# Altium schematic sheet Audio Amplifier 3W PAM8403 Schematics Layout.SchDoc
size A4; SheetNumber: 1; SheetTotal: 1
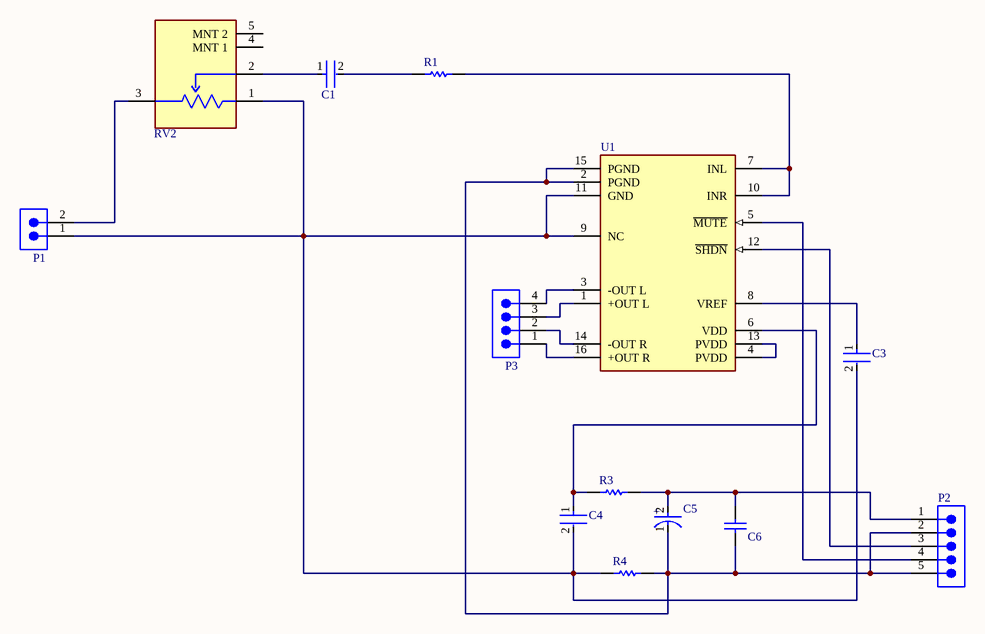
[diagram p0: Audio Amplifier 3W PAM8403 Schematics Layout.SchDoc]

## Parts
C1  LMK063BC6474MPLF  [FP-0201-L_0_6_0_09-W_0_3-MFG]  (value not drawn)
C3  GCD21BR72A104MA01L  [FP-GCD21B-0_15-MFG]  (value not drawn)
C4  GRM188R61A106ME69J  [FP-GRM188-0_15-IPC_C]  (value not drawn)
C5  EEUFM1E101B  [FP-RAD-TH-D_6_3_0_5-L_11-MFG]  (value not drawn)
C6  0805YD105MAT2A  [CAPC2013X140X50NL20T25]  (value not drawn)
P1  61300211121  [61300211121]  (value not drawn)
P2  61300511121  [61300511121]  (value not drawn)
P3  61300411121  [61300411121]  (value not drawn)
R1  20K 5% 1210(3225)  [RESC1210(3225)_M]  (value not drawn)
R3  RC1206FR-1010RL  [RESC3116X65X40LL10T20]  (value not drawn)
R4  SG73S1ETTP1R0J  [RESC1005X40X25LL10T10]  (value not drawn)
RV2  RK09L1140A2U  [FP-RK09L1140A2U-MFG]  (value not drawn)
U1  PAM8403DR  [FP-SO-16-MFG]  (value not drawn)

## Nets
NetC1_1: C1.1 RV2.2
NetC1_2: C1.2 R1.1
NetC3_1: C3.1 U1.8(VREF)
NetC3_2: C3.2 C4.2 P1.1 R4.1 RV2.1 U1.9(NC) U1.11(GND)
NetC4_1: C4.1 R3.1 U1.6(VDD)
NetC5_1: C5.1(C) C6.1 P2.2 P2.5 R4.2 U1.2(PGND) U1.15(PGND)
NetC5_2: C5.2(A) C6.2 P2.1 R3.2
NetP1_2: P1.2 RV2.3
NetP2_3: P2.3 U1.12(~{SHDN})
NetP2_4: P2.4 U1.5(~{MUTE})
NetP3_1: P3.1 U1.16(+OUT_R)
NetP3_2: P3.2 U1.14(-OUT_R)
NetP3_3: P3.3 U1.1(+OUT_L)
NetP3_4: P3.4 U1.3(-OUT_L)
NetR1_2: R1.2 U1.7(INL) U1.10(INR)
NetU1_4: U1.4(PVDD) U1.13(PVDD)

Not connected (* = marked no-connect by the designer): RV2 4(MNT_1) 5(MNT_2)

## Notes on the sheet
- (in symbol CMP-05427-000856-1) +

## Library data of the parts
C1 = CMP-14477-002327-2: 0.47 µF ±20% 10V Ceramic Capacitor X6S 0201 (0603 Metric); RoHS Compliant: Yes
C3 = CMP-06035-062053-1: Chip Multilayer Ceramic Capacitors for Automotive, 0805, 0.10uF, X7R, 15%, 20%, 100V, Grade 1
C4 = CMP-06035-033844-1: Chip Multilayer Ceramic Capacitors for General Purpose, 0603, 10uF, X5R, 15%, 20%, 10V; Dielectric: X5R; Thickness: 800um; Tolerance: 20%; Length: 1.6mm; Voltage Rating (DC): 10V; Width: 800um; Capacitance: 10uF
C5 = CMP-05427-000856-1: Aluminum Electrolytic Capacitors (Radial Lead Type) 100uF ±20% 25V; Lead Diameter: 0.5mm; Polarity: Polar; Ripple Current: 455mA; Impedance: 130mR; Life (Hours): 2000Hour; Length: 11mm; Min Operating Temperature: -40°C; Termination: Radial; Diameter: 6mm; Lead Pitch: 5mm; Tolerance: 20%; Capacitance: 100uF; Case/Package: Radial; Voltage Rating (DC): 25V; Height - Seated (Max): 0.5inch; RoHS Compliant: Yes; Series: FM; Package Quantity: 2000; Voltage Rating: 25V; Max Operating Temperature: 105°C; Mount: Through Hole; ESR (Equivalent Series Resistance): 130mR; Packaging: Tape and Reel
C6 = CMP-2007-04663-1: 1 µF ±20% 16V Ceramic Capacitor X5R 0805 (2012 Metric); Manufacturer: AVX Interconnect / Elco; Part Number: 0805YD105MAT2A
P1 = CMP-1712-00002-7: THT Vertical Pin Header WR-PHD, Pitch 2.54 mm, Single Row, 2 pins; Pitch: 2.54mm; Number of Contacts: 2; Connector Type: Male Pin; Gender: Male; Contact Resistance: 20mΩ; Operating Supply Voltage: 250V; Current Rating: 3A; Housing Material: PBT; RoHS: Compliant; Lead Free: Lead Free; Contact Material: Gold; REACH SVHC: No; Min Operating Temperature: -40°C; Termination: Through Hole; Number of Pins: 2; Contact Gender: Male; Packaging: Bulk; Lead Pitch: 2.54mm; Contact Plating: Gold; Orientation: Vertical; Mount: Through Hole; Height: 8.94mm; Color: Black; Number of Positions: 2; Contact Mating Length: 5.9944mm; Max Operating Temperature: 105°C; Voltage Rating: 250V; Number of Rows: 1
P2 = CMP-1502-01068-4: THT Vertical Pin Header WR-PHD, Pitch 2.54 mm, Single Row, 5 pins; Number of Contacts: 5; Connector Type: Male Pin; Operating Supply Voltage: 250V; Contact Resistance: 20mΩ; Gender: Male; Pitch: 2.54mm; Current Rating: 3A; Min Operating Temperature: -40°C; Contact Material: Gold; Color: Black; RoHS: Compliant; Number of Rows: 1; Lead Free: Lead Free; Height: 8.89mm; Contact Plating: Gold; Number of Pins: 5; Orientation: Vertical; Voltage Rating: 250V; Packaging: Bulk; Number of Positions: 5; Max Operating Temperature: 105°C; Termination: Solder; Lead Pitch: 2.54mm; Contact Mating Length: 5.9944mm; Mount: Through Hole
P3 = CMP-1502-01064-4: THT Vertical Pin Header WR-PHD, Pitch 2.54 mm, Single Row, 4 pins; Connector Type: Male Pin; Gender: Male; Current Rating: 3A; Number of Positions: 4; Operating Supply Voltage: 250V; Contact Resistance: 20mΩ; Pitch: 2.54mm; Max Operating Temperature: 105°C; Mount: Through Hole; Contact Material: Gold; Contact Plating: Gold; Number of Contacts: 4; Orientation: Vertical; Packaging: Bulk; Contact Mating Length: 5.9944mm; Voltage Rating: 250V; Number of Rows: 1; Height: 8.89mm; Lead Free: Lead Free; Lead Pitch: 2.54mm; Number of Pins: 4; Color: Black; Min Operating Temperature: -40°C; RoHS: Compliant; Termination: Solder
R1 = CMP-1015-00105-1: 20K 0.5W 5% 1210 (3225 Metric)  SMD; Value: 20000.00 Ohm; Case-EIA: 1210; Case-Metric: 3225; Power: 0.5 W; Tolerance: 5 %; Technology: SMT
R3 = CMP-2003-03446-1: Manufacturer: Yageo; Part Number: RC1206FR-1010RL
R4 = CMP-2002-04124-1: Manufacturer: KOA Speer; Part Number: SG73S1ETTP1R0J
RV2 = CMP-24118-000002-1: 9mm Size Metal Shaft Snap-in Type RK09L Series; Manufacturer: ALPS; Tolerance: 20%; Resistance: 10kΩ; Standoff Height: 2.55mm; Value: 10kΩ; Power Rating: 0.05W; Voltage Rating: 50V; Lead Free: Yes; Temperature: -10°C to +70°C; Device Class L1: Passive Components; ComponentLink2Description: Datasheet; Octopart: https://octopart.com/rk09l1140a2u-alps-7850070; Device Class L2: Resistors; Package: RK09L1140A2U; Height: 30mm; Category: Res; Temperature Range High: +70°C; Temperature Range Low: -10°C; RoHS: TRUE; Manufacturer Part Number: RK09L1140A2U; Series: RK09L; Automotive: No; ComponentLink2URL: https://www.alps.com/prod/info/E/HTML/Potentiometer/RotaryPotentiometers/RK09L/RK09L1140A2U.html; Device Class L3: Variable Resistors and Potentiometers
U1 = CMP-12733-000001-1: IC AMP CLASS D STEREO 3W 16SOP; Manufacturer: Diodes Inc.; Min Supply Voltage: 2.5V; Standoff Height: 0.1mm; Max Junction Temp: +125°C; Number Of Channels: 2; Power At Speaker R: 3.2W @ 4Ω; Nominal Supply Current: 8-16mA; Max Supply Voltage: 5.5V; Package: SO-16; Device Class L3: Amplifiers - Audio; Ipc Land Pattern Name: SOIC127P600X119-16; ComponentLink2URL: https://www.diodes.com/assets/Datasheets/PAM8403.pdf; Automotive: No; ComponentLink2Description: Datasheet; Device Class L1: Integrated Circuits (ICs); Digikey Description: IC AMP CLASS D STEREO 3W 16SOP; Temperature Range High: +85°C; Mouser Description: PAM8403 Series 5.5 V 3 W Filterless Class-D Stereo Audio Amplifier - SOIC-16; RoHS: TRUE; Temperature: -40°C to +85°C; Temperature Range Low: -40°C; Manufacturer Part Number: PAM8403DR; Octopart: https://octopart.com/pam8403dr-diodes+inc.-29030487; Device Class L2: Linear ICs; Category: IC; Footprint Url: https://www.diodes.com/assets/Package-Files/SO-16.pdf; Lead Free: Yes; Height: 1.26mm